# EasyEDA schematic 1-Schematic_Spirulina controler board.json
TITLE: Sheet_1; REV: 1.0; Date: 2021-05-11; Sheet: 1/1; Company: Your Company
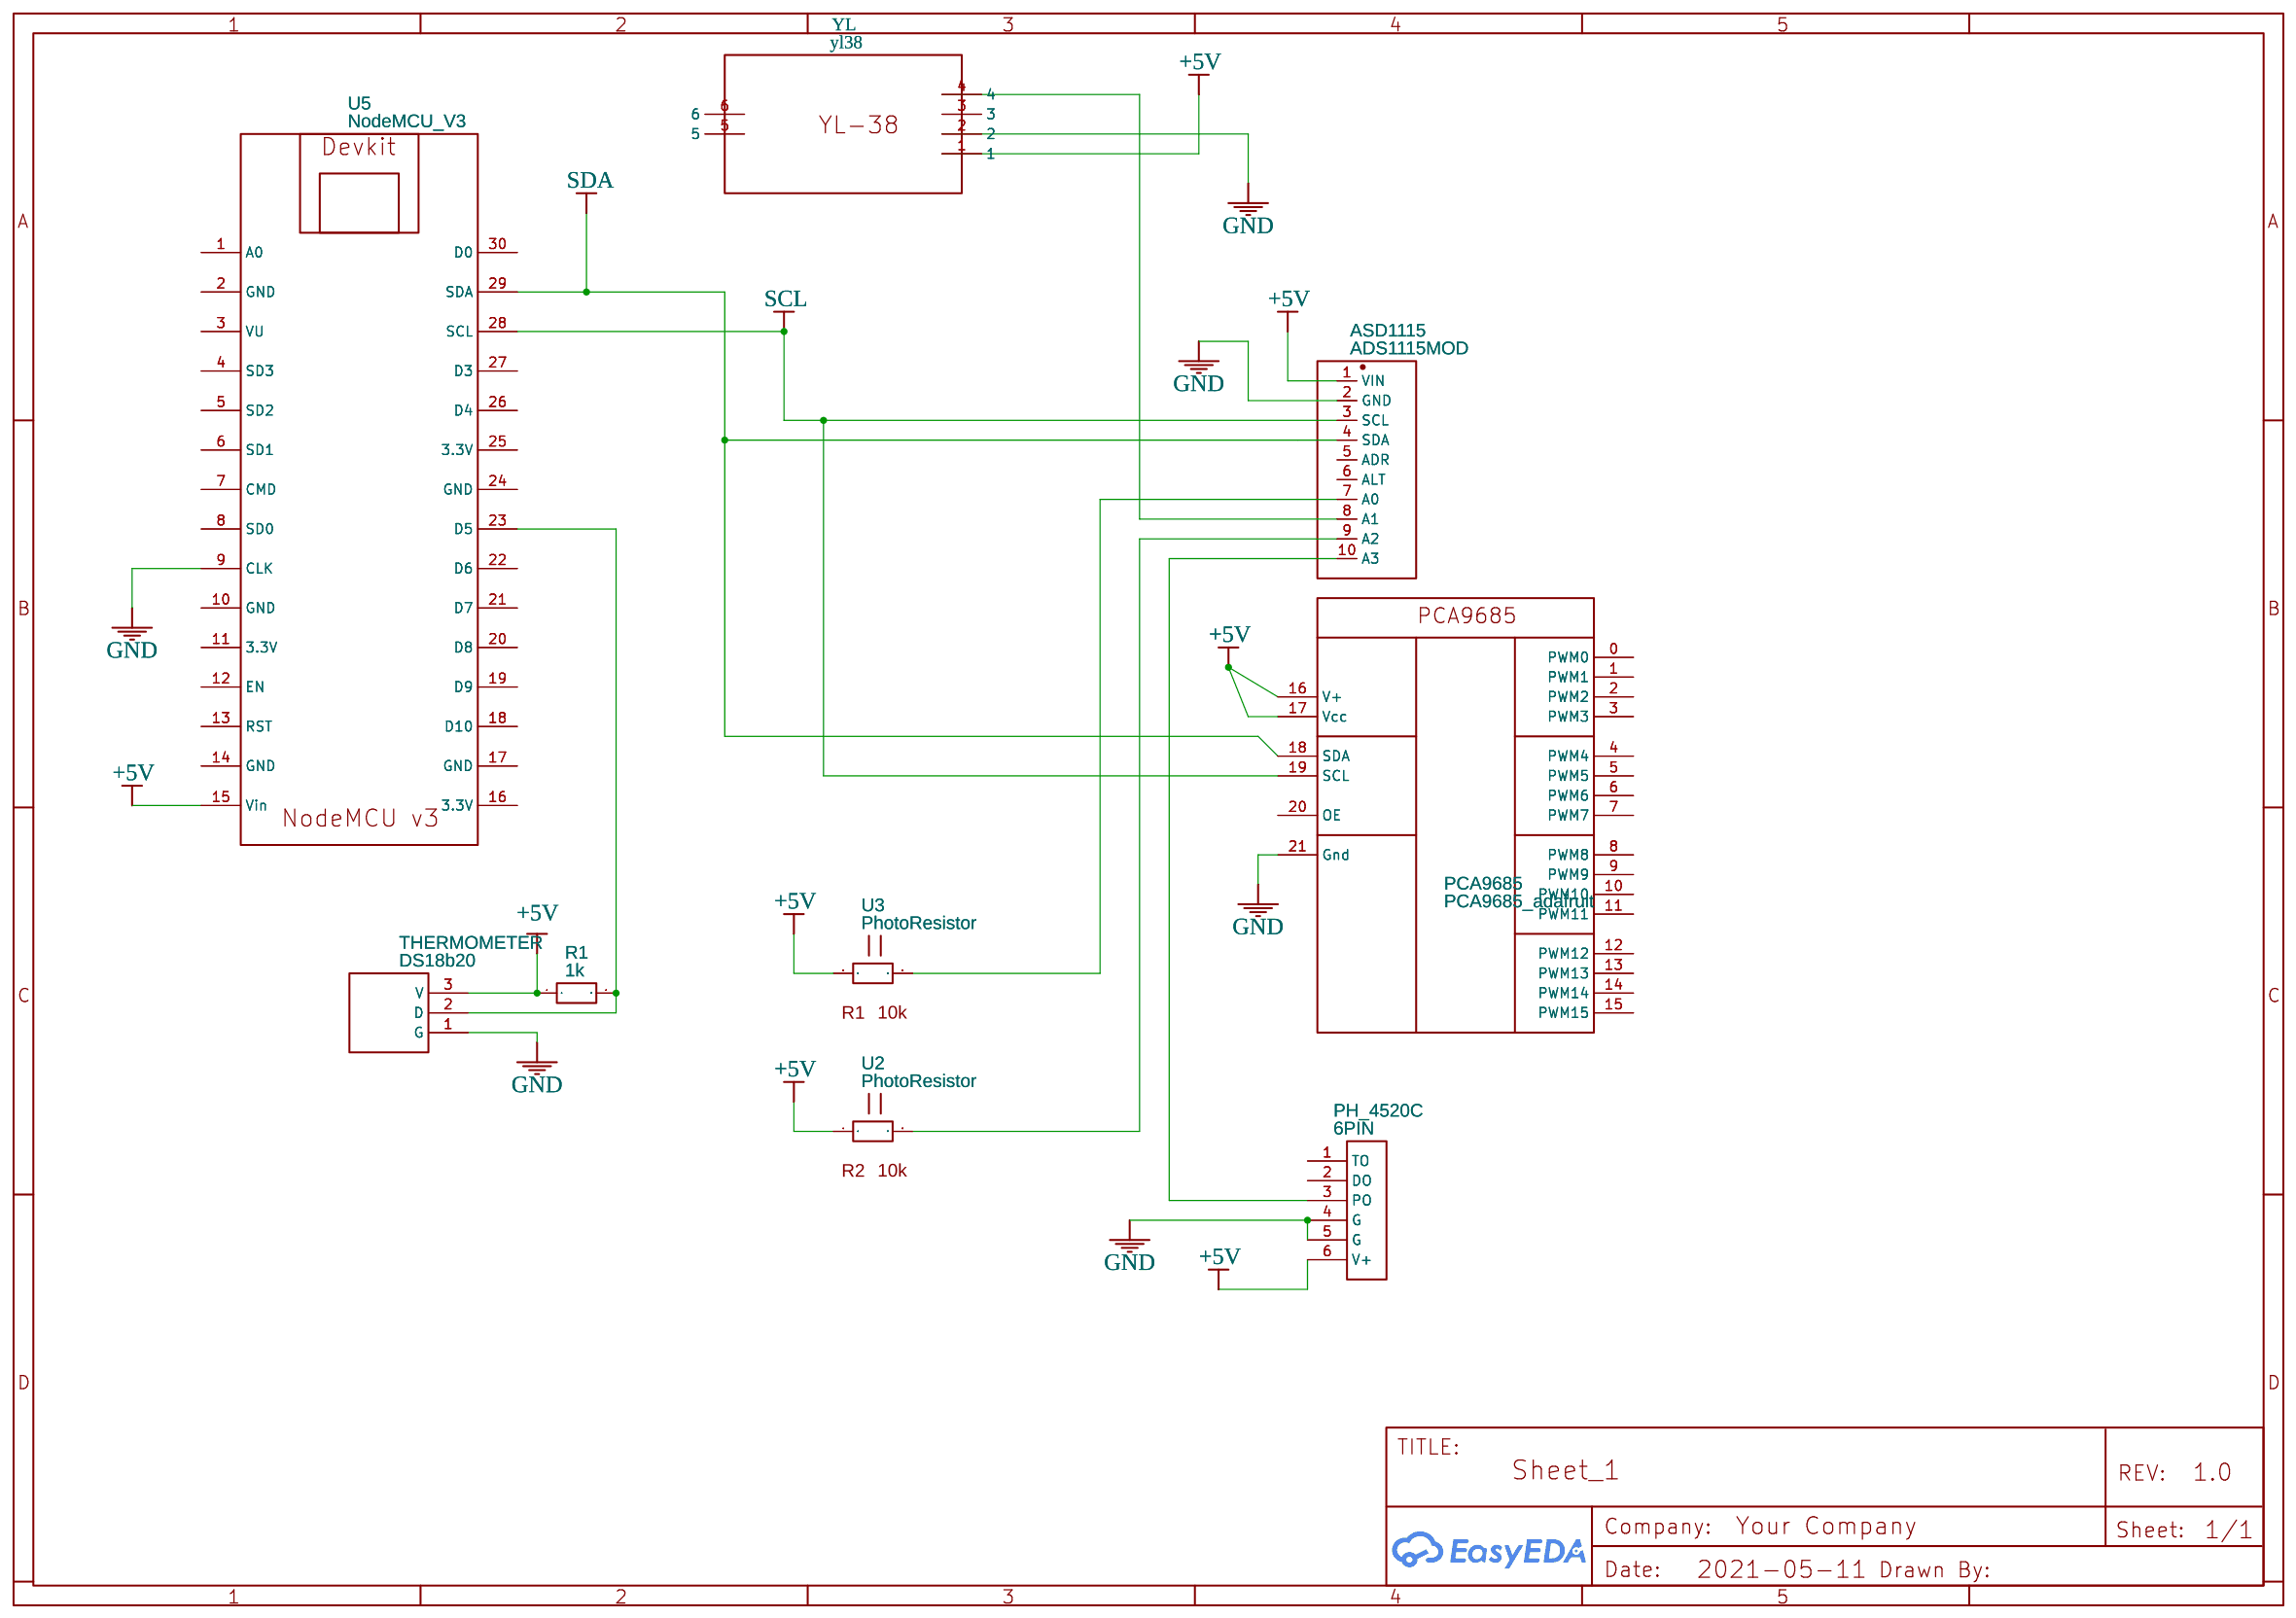
[diagram p0: schematic sheet]

## Parts
ASD1115  ADS1115MOD  [ADS1115 ADAFRUIT]
PCA9685  PCA9685_adafruit  [PCA9685 ADAFRUIT]
PH_4520C  6PIN  [6PIN]
R1  1k  [R0201]
THERMOMETER  DS18b20  [DS18B20]
U2  PhotoResistor  [RESISTOR_LDR_7X6_RM5.1]
U3  PhotoResistor  [RESISTOR_LDR_7X6_RM5.1]
U5  NodeMCU_V3  [NODEMCU_V3]
YL  yl38  [YL-38]

## Library data of the parts
ASD1115 = ADS1115MOD: sim: true; Contributor: Uhunsya
PCA9685 = PCA9685_adafruit: Contributor: KOXOV
PH_4520C = 6PIN: catid: 20; Contributor: Rekin2137; sim: true
R1 = R_0201_EU: Contributor: LCEDA_Lib
THERMOMETER = DS18b20: Contributor: PiotrMk
U2 U3 = PhotoResistor: Contributor: SWC_PCB
U5 = NodeMCU_V3

## Nets
+5V: ASD1115.1(VIN) PCA9685.16(V+) PCA9685.17(Vcc) PH_4520C.6(V+) R1.1 THERMOMETER.3(V) U2.1 U3.1 U5.15(Vin) YL.1
GND: ASD1115.2(GND) PCA9685.21(Gnd) PH_4520C.4(G) PH_4520C.5(G) THERMOMETER.1(G) U5.9(CLK) YL.2
SCL: ASD1115.3(SCL) PCA9685.19(SCL) U5.28(SCL)
SDA: ASD1115.4(SDA) PCA9685.18(SDA) U5.29(SDA)
Net-(ASD1115-7): ASD1115.7(A0) U3.2
Net-(ASD1115-8): ASD1115.8(A1) YL.4
Net-(ASD1115-9): ASD1115.9(A2) U2.2
Net-(ASD1115-10): ASD1115.10(A3) PH_4520C.3(PO)
Net-(R1-2): R1.2 THERMOMETER.2(D) U5.23(D5)

Not connected (* = marked no-connect by the designer): ASD1115 5(ADR) 6(ALT); PCA9685 0(PWM0) 1(PWM1) 2(PWM2) 3(PWM3) 4(PWM4) 5(PWM5) 6(PWM6) 7(PWM7) 8(PWM8) 9(PWM9) 10(PWM10) 11(PWM11) 12(PWM12) 13(PWM13) 14(PWM14) 15(PWM15) 20(OE); PH_4520C 1(TO) 2(DO); U5 1(A0) 2(GND) 3(VU) 4(SD3) 5(SD2) 6(SD1) 7(CMD) 8(SD0) 10(GND) 11(3.3V) 12(EN) 13(RST) 14(GND) 16(3.3V) 17(GND) 18(D10) 19(D9) 20(D8) 21(D7) 22(D6) 24(GND) 25(3.3V) 26(D4) 27(D3) 30(D0); YL 3 5 6
